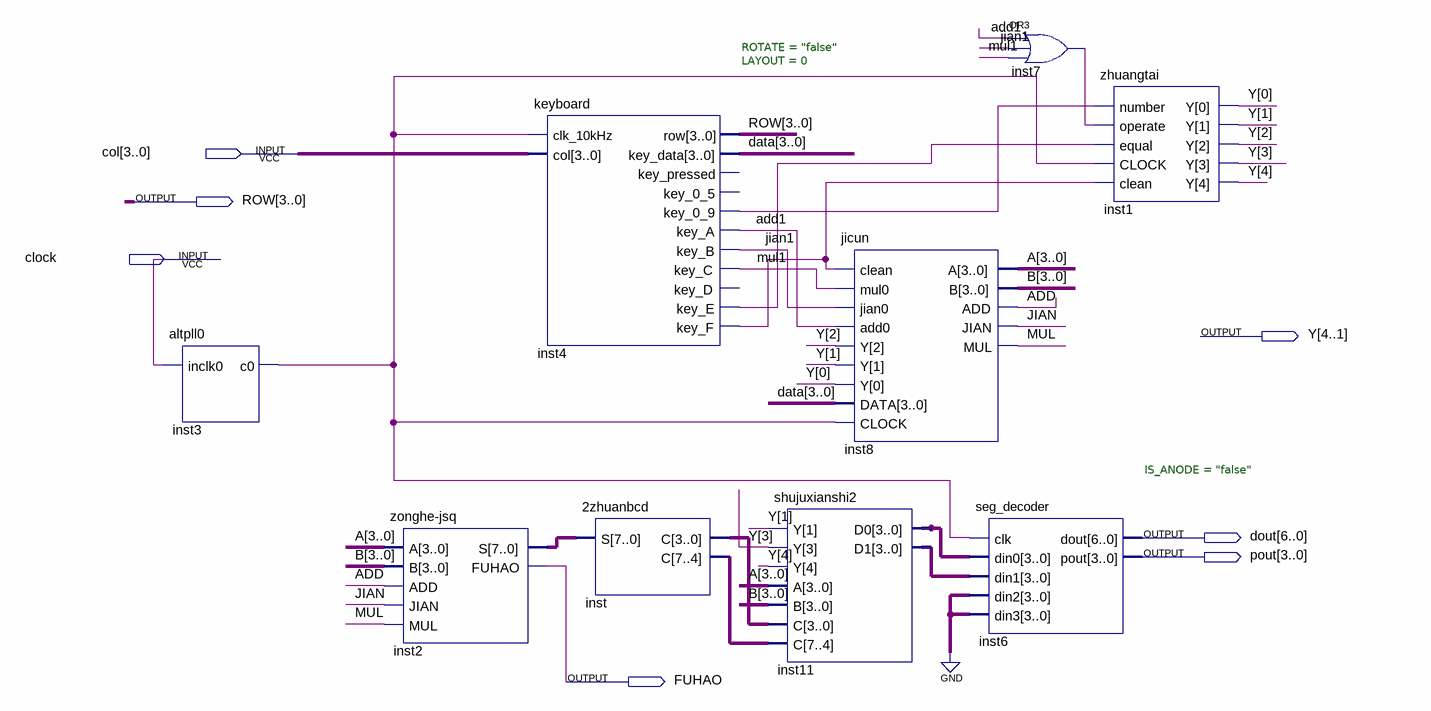
[diagram p0: schematic sheet]
// Quartus schematic dingduan.bdf as structural Verilog: 9 symbols, 7 pins
module dingduan (
  input  [3:0] col,
  input  clock,
  output [3:0] ROW,
  output [4:0] Y,
  output [6:0] dout,
  output [3:0] pout,
  output FUHAO
);

  wire ADD, add1, inst3_c0, inst4_key_0_9, inst4_key_e, inst4_key_f, inst7_out, JIAN, jian1, MUL, mul1;
  wire [3:0] A, B, data, inst11_d0, inst11_d1, inst_c, inst_c_2;
  wire [7:0] inst2_s;

  altpll0 inst3 (.inclk0(clock), .c0(inst3_c0));
  \zonghe-jsq  inst2 (.A(A), .B(B), .ADD(ADD), .JIAN(JIAN), .MUL(MUL), .S(inst2_s), .FUHAO(FUHAO));
  keyboard #(.ROTATE("false"), .LAYOUT(0)) inst4 (
    .clk_10kHz(inst3_c0), .col(col), .row(ROW), .key_data(data), .key_0_9(inst4_key_0_9), .key_A(add1),
    .key_B(jian1), .key_C(mul1), .key_E(inst4_key_e), .key_F(inst4_key_f));  // open: key_pressed, key_0_5, key_D
  \2zhuanbcd  inst (.S(inst2_s), .C({inst_c_2, inst_c}));
  shujuxianshi2 inst11 (.Y({Y[4:3], Y[1]}), .A(A), .B(B), .C({inst_c_2, inst_c}), .D0(inst11_d0), .D1(inst11_d1));
  jicun inst8 (
    .clean(inst4_key_f), .mul0(mul1), .jian0(jian1), .add0(add1), .Y(Y[2:0]), .DATA(data), .CLOCK(inst3_c0),
    .A(A), .B(B), .ADD(ADD), .JIAN(JIAN), .MUL(MUL));
  or inst7 (inst7_out, add1, jian1, mul1);
  seg_decoder #(.IS_ANODE("false")) inst6 (
    .clk(inst3_c0), .din0(inst11_d0), .din1(inst11_d1), .din2(4'b0000), .din3(4'b0000), .dout(dout),
    .pout(pout));
  zhuangtai inst1 (
    .number(inst4_key_0_9), .operate(inst7_out), .equal(inst4_key_e), .CLOCK(inst3_c0), .clean(inst4_key_f),
    .Y(Y));
endmodule
